# Altium schematic sheet PSU_ZXCL330_3V3.SchDoc: PSU TPS75501 1V8
size A4; Organization: Altium Limited.; Address1: Level 3, 12a Rodborough Rd; Address2: Frenchs Forest 2086; Address3: NSW; Address4: AUSTRALIA; DocumentNumber: 39; SheetNumber: 40; SheetTotal: 77
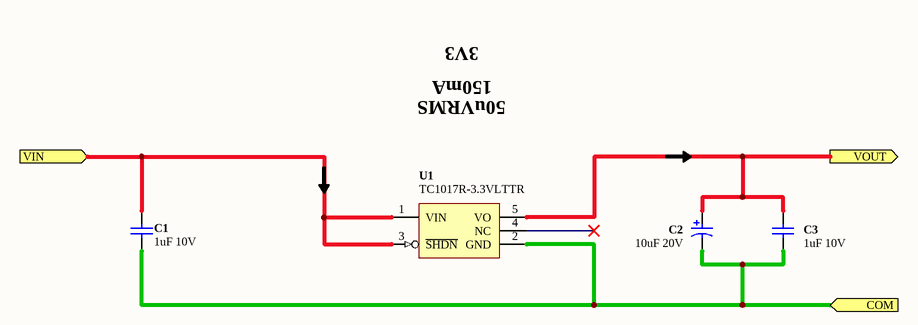
[diagram p0: PSU_ZXCL330_3V3.SchDoc]

## Parts
C1  1uF 10V  [CAPC1005-STAR]
C2  10uF 20V  [CAPC3528-STAR]
C3  1uF 10V  [CAPC1005-STAR]
U1  TC1017R-3.3VLTTR  [SOT65P210X80-5N]

## Ports
COM (in), VIN (in), VOUT (out)

## Nets
COM: C1.1 C2.2 C3.1 U1.2(GND) ; port COM
VIN: C1.2 U1.1(VIN) U1.3(~{SHDN}) ; port VIN
VOUT: C2.1 C3.2 U1.5(VO) ; port VOUT

Not connected (* = marked no-connect by the designer): U1 4(NC)*

## Notes on the sheet
- 3V3
- 150mA
- 50uVRMS
- Sheet Title
- Project Title
- Size:
- Date:
- A4
- Assy:
- Time:
- Revision:
- Sheet
- of
- File:

## Library data of the parts
C1 C3 = D-101-0131: Capacitor, Ceramic, 1uF 10% 10V 0402 (1005) X5R; Polarity: Non-Polarized; Category: Capacitor; Capacitance: 1 uF; Dielectric: X5R; Mounting Technology: Surface Mount; Rated Voltage: 10 V; Status: Unreleased; Technology: None; Tolerance: 10 %
C2 = D-101-0007: Capacitor, Tantalum, 10uF 10% 20V MCCT-B (3528); Polarity: Polarized; Category: Capacitor; Capacitance: 10 uF; Mounting Technology: Surface Mount; Rated Voltage: 20 V; Status: Production; Technology: Tantalum; Tolerance: 10 %
U1 = D-204-0035: TC1017R-3.3VLTTR, 3.3V Micropower Low Dropout Regulator, 5-Pin SC70-5; Max Input Voltage: 5.5 V; Max Output Current: 150 mA; Min Input Voltage: mV; Supply Voltage: V; Max Output Voltage: 3.3 V; Min Output Voltage: mV; Mounting Technology: Surface Mount; Status: Unreleased; Temperature Range: -40 to 85 degC; Category: IC-Power